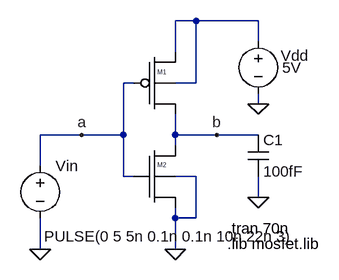
[diagram p0: schematic cmos.asc]
cmos.asc, the LTspice schematic file:
Version 4
SHEET 1 1292 680
WIRE -592 -96 -624 -96
WIRE -496 -96 -592 -96
WIRE -496 -64 -496 -96
WIRE -624 -48 -624 -96
WIRE -688 0 -704 0
WIRE -592 0 -592 -96
WIRE -592 0 -624 0
WIRE -496 32 -496 16
WIRE -768 80 -832 80
WIRE -704 80 -704 0
WIRE -704 80 -768 80
WIRE -624 80 -624 48
WIRE -560 80 -624 80
WIRE -496 80 -560 80
WIRE -624 96 -624 80
WIRE -832 128 -832 80
WIRE -704 144 -704 80
WIRE -688 144 -704 144
WIRE -592 144 -624 144
WIRE -496 176 -496 144
WIRE -624 208 -624 192
WIRE -592 208 -592 144
WIRE -592 208 -624 208
WIRE -832 256 -832 208
WIRE -624 256 -624 208
FLAG -624 256 0
FLAG -496 32 0
FLAG -832 256 0
FLAG -768 80 a
FLAG -560 80 b
FLAG -496 176 0
SYMBOL voltage -496 -80 R0
WINDOW 123 0 0 Left 2
WINDOW 39 0 0 Left 2
WINDOW 0 35 38 Left 2
WINDOW 3 37 56 Left 2
SYMATTR InstName Vdd
SYMATTR Value 5V
SYMBOL voltage -832 112 R0
WINDOW 123 0 0 Left 2
WINDOW 39 0 0 Left 2
WINDOW 3 6 124 Left 2
SYMATTR Value PULSE(0 5 5n 0.1n 0.1n 10n 22n 3)
SYMATTR InstName Vin
SYMBOL pmos -672 -48 R0
SYMATTR InstName M1
SYMATTR Value2 l=1u w=12u
SYMATTR SpiceModel ""
SYMATTR Value P_1u
SYMBOL nmos -672 96 R0
SYMATTR InstName M2
SYMATTR SpiceModel ""
SYMATTR Value N_1u
SYMATTR Value2 l=1u w=12u
SYMBOL cap -512 80 R0
SYMATTR InstName C1
SYMATTR Value 100fF
TEXT -544 224 Left 2 !.tran 70n
TEXT -544 248 Left 2 !.lib mosfet.lib

The netlist it stands for:
* cmos.asc
Vdd N001 0 5V
Vin a 0 PULSE(0 5 5n 0.1n 0.1n 10n 22n 3)
M1 N001 a b N001 P_1u l=1u w=12u
M2 b a 0 0 N_1u l=1u w=12u
C1 b 0 100fF
.model NMOS NMOS
.model PMOS PMOS
.lib standard.mos
.tran 70n
.lib mosfet.lib
.backanno
.end